# Altium schematic sheet Ref.SchDoc
size A
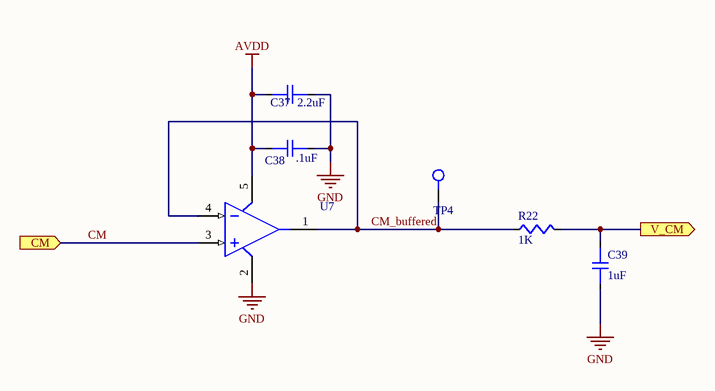
[diagram p0: Ref.SchDoc]

## Parts
C37  2.2uF  [C0603]
C38  .1uF  [C0603]
C39  1uF  [C0603]
R22  1K  [R0603]
TP4  TP  [TP_5029]  (value not drawn)
U7  OPA325  [SOT-23-5]  (value not drawn)

## Ports
CM (in), V_CM (out)

## Nets
AVDD: C37.1 C38.1 U7.5(VS+)
GND: C37.2 C38.2 C39.1 U7.2(VS-)
CM: U7.3(+IN) ; port CM
CM_buffered: R22.1 TP4.1 U7.1(OUT) U7.4(-IN)
V_CM: C39.2 R22.2 ; port V_CM

## Library data of the parts
C37 = VJ0603Y224KXJCW1BC: Cap Ceramic 0.22uF 16V X7R 10% SMD 0603 125C Paper T/R; Manufacturer 1: Vishay Vitramon; Dielectric Material: Tantalum; Capacitance: 220nF; Supplier 1: Digi-Key; Supplier Part Number 1: 720-1853-1-ND; Manufacturer Part Number 1: VJ0603Y224KXJCW1BC; Stock 1: 890490; Pricing 1: 1=0.10000, 10=0.07000, 100=0.03100, 500=0.02214, 1000=0.01739 (USD); RoHS: Yes; Mount: Surface Mount; Case/Package: 0603; Min Operating Temperature: -55°C; Max Operating Temperature: 125°C; Tolerance: 10%; Packaging: Tape and Reel; Dielectric: X7R; Voltage Rating (DC): 16V; Length: 1.6mm; Depth: 0.8mm; Lead Free: Lead Free; ComponentLink1URL: https://datasheet.ciiva.com/11490/vjw1bcbascomseries-11490982.pdf?src-supplier=Avnet; ComponentLink1Description: https://datasheet.ciiva.com/11490/vjw1bcbascomseries-11490982.pdf?src-supplier=Avnet
C38 = VJ0603Y104JXJCW1BC: 0603 0.1 uF 16 V ±5 % Tolerance X7R SMT Multilayer Ceramic Chip Capacitor; Manufacturer 1: Vishay Vitramon; Dielectric Material: Tantalum; Tolerance: 5%; Capacitance: 100nF; Voltage Rating: 16V; Supplier 1: Digi-Key; Supplier Part Number 1: 720-1685-1-ND; Manufacturer Part Number 1: VJ0603Y104JXJCW1BC; Stock 1: 6936; Pricing 1: 1=0.20000, 10=0.13400, 100=0.06780, 500=0.04636, 1000=0.04101 (USD); RoHS: Yes; Mount: Surface Mount; Case/Package: 0603; Number of Pins: 2; Case Code (Imperial): 0603; Case Code (Metric): 1608; Contact Plating: Tin,Matte; Min Operating Temperature: -55°C; Max Operating Temperature: 125°C; Packaging: Tape and Reel; Voltage Rating (DC): 16V; Package Quantity: 4000; Dielectric: X7R; Termination: SMD/SMT; Length: 1.6mm; Height: 0.95mm; Width: 0.8mm; Depth: 0.8mm; Lead Free: Lead Free; ComponentLink1URL: https://datasheet.ciiva.com/5424/vjw1bcbascomseries-223529-5424533.pdf?src-supplier=Mouser; ComponentLink1Description: https://datasheet.ciiva.com/5424/vjw1bcbascomseries-223529-5424533.pdf?src-supplier=Mouser; ComponentLink2URL: https://datasheet.ciiva.com/11491/vjw1bcbascomseries-11491768.pdf?src-supplier=Avnet; ComponentLink2Description: https://datasheet.ciiva.com/11491/vjw1bcbascomseries-11491768.pdf?src-supplier=Avnet; ComponentLink3URL: https://datasheet.ciiva.com/16215/vjw1bcbascomseries-16215161.pdf?src-supplier=Future+Electronics; ComponentLink3Description: https://datasheet.ciiva.com/16215/vjw1bcbascomseries-16215161.pdf?src-supplier=Future+Electronics
C39 = CL10B105KO8NNNC: Cap Ceramic 1uF 16V X7R 10% SMD 0603 125C T/R; Manufacturer 1: Samsung; Supplier 1: Digi-Key; Supplier Part Number 1: 1276-1019-1-ND; Manufacturer Part Number 1: CL10B105KO8NNNC; Stock 1: 4048324; Pricing 1: 1=0.10000, 10=0.04800, 100=0.02120, 500=0.01516, 1000=0.01192 (USD); RoHS: Yes; Mount: Surface Mount; Case/Package: 0603; Case Code (Metric): 1608; Case Code (Imperial): 0603; Material: Ceramic; Min Operating Temperature: -55°C; Max Operating Temperature: 125°C; Packaging: Tape and Reel; Tolerance: 10%; Capacitance: 1uF; Voltage Rating: 16V; Dielectric: X7R; Voltage: 16V; Voltage Rating (DC): 16V; Length: 1.6mm; Height: 0.8mm; Width: 0.031inch; Thickness: 0.035inch; Depth: 0.8mm; Radiation Hardening: No; Lead Free: Lead Free; ComponentLink1URL: https://datasheet.ciiva.com/15195/getdatasheetpartid-357418-15195728.pdf?src-supplier=Verical; ComponentLink1Description: https://datasheet.ciiva.com/15195/getdatasheetpartid-357418-15195728.pdf?src-supplier=Verical; ComponentLink2URL: https://datasheet.ciiva.com/29198/458176-da-01-en-vs-kondensator-0603-29198478.pdf?src-supplier=Conrad; ComponentLink2Description: https://datasheet.ciiva.com/29198/458176-da-01-en-vs-kondensator-0603-29198478.pdf?src-supplier=Conrad
R22 = TNPW06031K00BEEA: RES 1K OHM 0.1% 1/8W 0603; Manufacturer 1: Vishay Dale; Tolerance: 1%; Resistance: 1kR; Temperature Coefficient: 25ppm/°C; Power Rating: 100mW; Voltage Rating: 75V; Supplier 1: Digi-Key; Supplier Part Number 1: TNP1.00KAACT-ND; Manufacturer Part Number 1: TNPW06031K00BEEA; Stock 1: 92047; Pricing 1: 1=0.65000, 10=0.46200, 100=0.24020, 1000=0.12936, 2500=0.12760 (USD); RoHS: Yes; Mount: Surface Mount; Case/Package: 0603; Weight: 7.1E-05oz; Contact Plating: Tin; Case Code (Metric): 1608; Case Code (Imperial): 0603; Min Operating Temperature: -55°C; Max Operating Temperature: 125°C; Composition: Thin Film; Packaging: Tape and Reel; Package Quantity: 1; Number of Terminations: 2; Termination: SMD/SMT; Military Standard: Not; Max Power Dissipation: 100mW; Voltage Rating (DC): 75V; Features: Moisture Resistant,Automotive AEC-Q200,Anti-Sulfur; Length: 1.6mm; Height: 0.45mm; Width: 0.033inch; Depth: 0.85mm; Radiation Hardening: No; REACH SVHC: Unknown; Lead Free: Lead Free; ComponentLink1URL: https://datasheet.ciiva.com/2528/tnpw-e3-2528472.pdf?src-supplier=Digi-Key; ComponentLink1Description: https://datasheet.ciiva.com/2528/tnpw-e3-2528472.pdf?src-supplier=Digi-Key; ComponentLink2URL: https://datasheet.ciiva.com/2528/tnpw-e3-2528473.pdf?src-supplier=Digi-Key; ComponentLink2Description: https://datasheet.ciiva.com/2528/tnpw-e3-2528473.pdf?src-supplier=Digi-Key; ComponentLink3URL: https://datasheet.ciiva.com/9112/tnpw-e3-9112138.pdf?src-supplier=Avnet; ComponentLink3Description: https://datasheet.ciiva.com/9112/tnpw-e3-9112138.pdf?src-supplier=Avnet; ComponentLink4URL: https://datasheet.ciiva.com/16391/tnpw-e3-16391675.pdf?src-supplier=Future+Electronics; ComponentLink4Description: https://datasheet.ciiva.com/16391/tnpw-e3-16391675.pdf?src-supplier=Future+Electronics; ComponentLink5URL: https://datasheet.ciiva.com/9112/tnpw-e3-9112141.pdf?src-supplier=Avnet; ComponentLink5Description: https://datasheet.ciiva.com/9112/tnpw-e3-9112141.pdf?src-supplier=Avnet; ComponentLink6URL: https://datasheet.ciiva.com/16782/70201627-16782047.pdf?src-supplier=Allied+Electronics; ComponentLink6Description: https://datasheet.ciiva.com/16782/70201627-16782047.pdf?src-supplier=Allied+Electronics
TP4 = TP: RCT-0C SMD 0805 TP; Supplier 1: Digi-Key; Supplier Part Number 1: A106144CT-ND
U7 = OPA325IDBVR: Manufacturer 1: Texas Instruments; Supplier 1: Digi-Key; Supplier Part Number 1: 296-OPA325IDBVRCT-ND; Manufacturer Part Number 1: OPA325IDBVR; Stock 1: 2034; Pricing 1: 1=1.69000, 10=1.51600, 25=1.43000, 100=1.14400, 250=1.00100, 500=0.97240, 1000=0.77220 (USD); RoHS: No